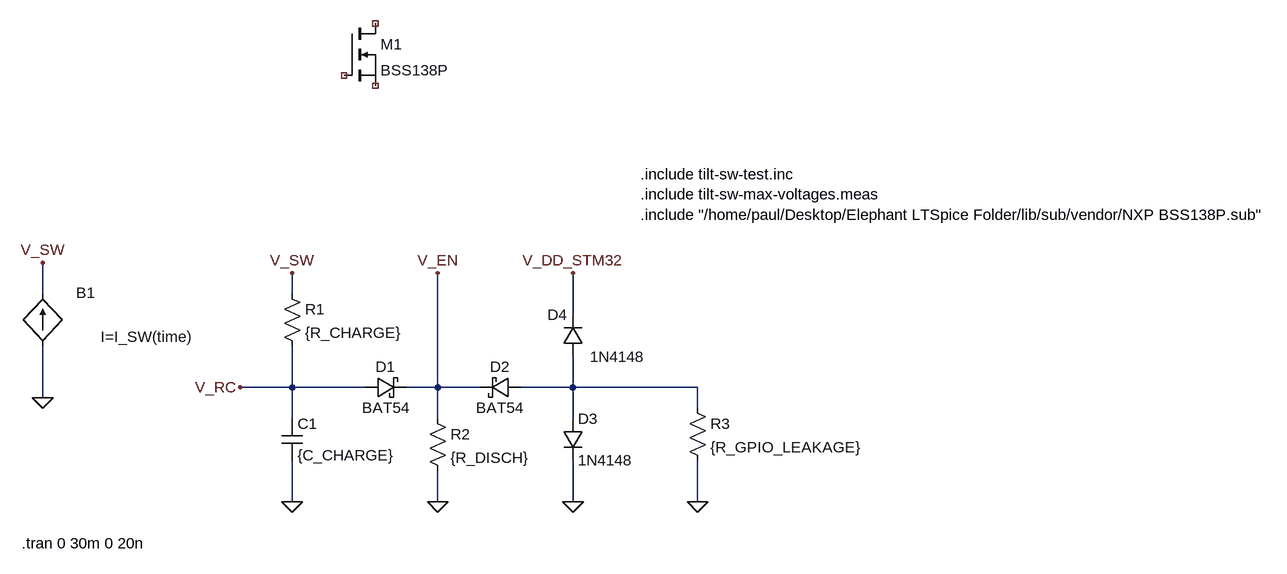
[diagram p0: schematic tilt-sw-test.asc]
tilt-sw-test.asc, the LTspice schematic file:
Version 4.1
SHEET 1 2496 1868
WIRE -896 -256 -896 -304
WIRE -512 -256 -512 -288
WIRE -80 -224 -80 -288
WIRE -512 -112 -512 -176
WIRE -512 -112 -592 -112
WIRE -400 -112 -512 -112
WIRE -288 -112 -288 -288
WIRE -288 -112 -336 -112
WIRE -224 -112 -288 -112
WIRE -80 -112 -80 -160
WIRE -80 -112 -160 -112
WIRE 112 -112 -80 -112
WIRE -896 -96 -896 -176
WIRE 112 -80 112 -112
WIRE -512 -64 -512 -112
WIRE -288 -64 -288 -112
WIRE -80 -64 -80 -112
WIRE -512 64 -512 0
WIRE -288 64 -288 16
WIRE -80 64 -80 0
WIRE 112 64 112 0
FLAG -896 -304 V_SW
FLAG -896 -96 0
FLAG -288 -288 V_EN
FLAG -592 -112 V_RC
FLAG -80 64 0
FLAG -80 -288 V_DD_STM32
FLAG -288 64 0
FLAG -512 64 0
FLAG -512 -288 V_SW
FLAG 112 64 0
SYMBOL res -528 -272 R0
SYMATTR InstName R1
SYMATTR Value {R_CHARGE}
SYMBOL cap -528 -64 R0
SYMATTR InstName C1
SYMATTR Value {C_CHARGE}
SYMBOL schottky -400 -96 R270
WINDOW 0 32 32 VTop 2
WINDOW 3 0 32 VBottom 2
SYMATTR InstName D1
SYMATTR Value BAT54
SYMATTR Description Diode
SYMATTR Type diode
SYMBOL schottky -160 -128 R90
WINDOW 0 0 32 VBottom 2
WINDOW 3 32 32 VTop 2
SYMATTR InstName D2
SYMATTR Value BAT54
SYMATTR Description Diode
SYMATTR Type diode
SYMBOL res -304 -80 R0
SYMATTR InstName R2
SYMATTR Value {R_DISCH}
SYMBOL diode -96 -64 R0
SYMATTR InstName D3
SYMATTR Value 1N4148
SYMBOL diode -64 -160 R180
WINDOW 0 24 64 Left 2
WINDOW 3 -95 -1 Left 2
SYMATTR InstName D4
SYMATTR Value 1N4148
SYMBOL res 96 -96 R0
SYMATTR InstName R3
SYMATTR Value {R_GPIO_LEAKAGE}
SYMBOL bi -896 -176 R180
WINDOW 0 -81 82 Left 2
WINDOW 3 -231 14 Left 2
SYMATTR InstName B1
SYMATTR Value I=I_SW(time)
SYMBOL nmos -432 -672 R0
SYMATTR InstName M1
SYMATTR Value BSS138P
TEXT -928 128 Left 2 !.tran 0 30m 0 20n
TEXT 24 -440 Left 2 !.include tilt-sw-test.inc\n.include tilt-sw-max-voltages.meas\n.include "/home/paul/Desktop/Elephant LTSpice Folder/lib/sub/vendor/NXP BSS138P.sub"

The netlist it stands for:
* tilt-sw-test.asc
R1 V_SW V_RC {R_CHARGE}
C1 V_RC 0 {C_CHARGE}
D1 V_RC V_EN BAT54
D2 N001 V_EN BAT54
R2 V_EN 0 {R_DISCH}
D3 N001 0 1N4148
D4 N001 V_DD_STM32 1N4148
R3 N001 0 {R_GPIO_LEAKAGE}
B1 0 V_SW I=I_SW(time)
M1 NC_01 NC_02 NC_03 NC_03 BSS138P
.model D D
.lib standard.dio
.model NMOS NMOS
.model PMOS PMOS
.lib standard.mos
.tran 0 30m 0 20n
.include tilt-sw-test.inc
.include tilt-sw-max-voltages.meas
.include "/home/paul/Desktop/Elephant LTSpice Folder/lib/sub/vendor/NXP BSS138P.sub"
.backanno
.end